# Altium schematic sheet ADC_AVN.SchDoc
size Tabloid; SheetNumber: 3; SheetTotal: 5
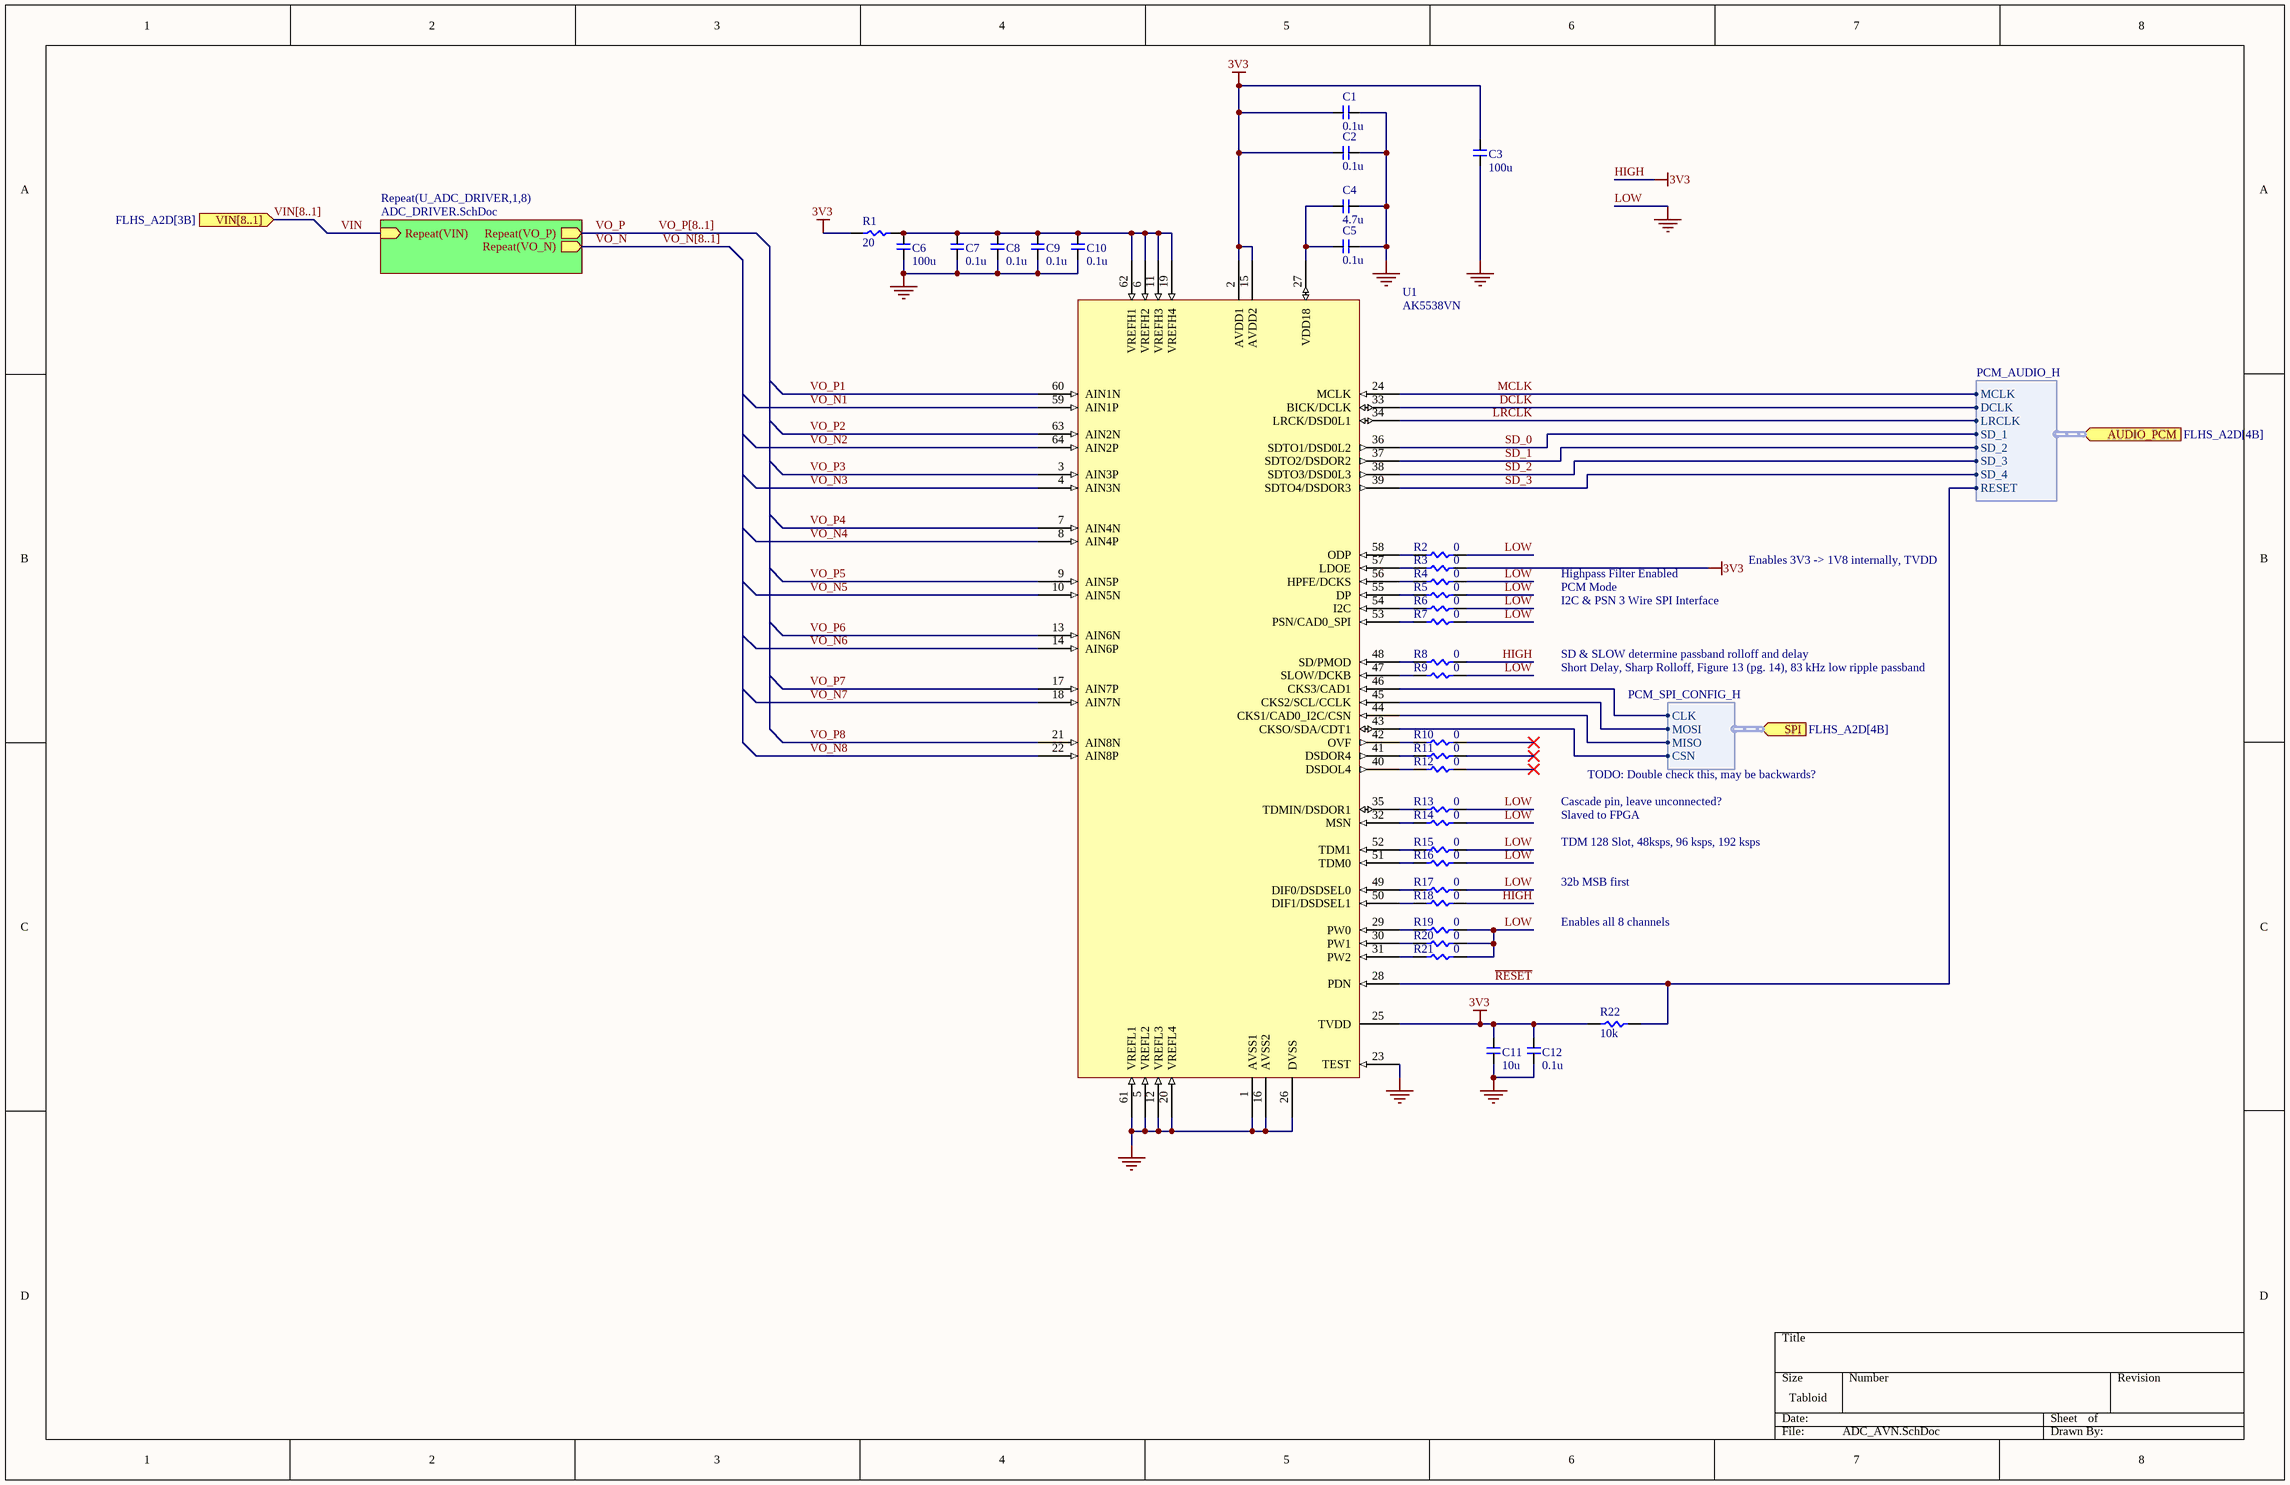
[diagram p0: ADC_AVN.SchDoc]

## Parts
C1  0.1u  [CAP_0402]
C2  0.1u  [CAP_0402]
C3  100u
C4  4.7u  [CAP_0603]
C5  0.1u  [CAP_0402]
C6  100u
C7  0.1u  [CAP_0402]
C8  0.1u  [CAP_0402]
C9  0.1u  [CAP_0402]
C10  0.1u  [CAP_0402]
C11  10u
C12  0.1u  [RES_0402]
R1  20  [RES_0402]
R2  0  [RES_0402]
R3  0  [RES_0402]
R4  0  [RES_0402]
R5  0  [RES_0402]
R6  0  [RES_0402]
R7  0  [RES_0402]
R8  0  [RES_0402]
R9  0  [RES_0402]
R10  0  [RES_0402]
R11  0  [RES_0402]
R12  0  [RES_0402]
R13  0  [RES_0402]
R14  0  [RES_0402]
R15  0  [RES_0402]
R16  0  [RES_0402]
R17  0  [RES_0402]
R18  0  [RES_0402]
R19  0  [RES_0402]
R20  0  [RES_0402]
R21  0  [RES_0402]
R22  10k  [RES_0402]
U1  AK5538VN  [AK5538VN_QFN127P600-8N]

## Sub-sheets
Repeat(U_ADC_DRIVER,1,8) = ADC_DRIVER.SchDoc: Repeat(VIN) (in), Repeat(VO_P) (out), Repeat(VO_N) (out)

## Ports
AUDIO_PCM (in, harness PCM_AUDIO_H, see FLHS_A2D[4B]), SPI (in, harness PCM_SPI_CONFIG_H, see FLHS_A2D[4B]), VIN[8..1] (in, see FLHS_A2D[3B])

## Harnesses
PCM_AUDIO_H: MCLK, DCLK, LRCLK, SD_1, SD_2, SD_3, SD_4, RESET
PCM_SPI_CONFIG_H: CLK, MOSI, MISO, CSN

## Nets
HIGH: C1.1 C2.1 C3.2 C11.2 C12.2 R1.1 R3.1 R8.1 R18.1 R22.1 U1.2(AVDD1) U1.15(AVDD2) U1.25(TVDD)  [also labelled 3V3]
LOW: C1.2 C2.2 C3.1 C4.2 C5.2 C6.1 C7.1 C8.1 C9.1 C10.1 C11.1 C12.1 R2.1 R4.1 R5.1 R6.1 R7.1 R9.1 R13.1 R14.1 R15.1 R16.1 R17.1 R19.1 R20.1 R21.1 U1.1(AVSS1) U1.5(VREFL2) U1.12(VREFL3) U1.16(AVSS2) U1.20(VREFL4) U1.23(TEST) U1.26(DVSS) U1.61(VREFL1)  [also labelled GND]
~{RESET}: R22.0 U1.28(PDN) ; port AUDIO_PCM.RESET
DCLK: U1.33(BICK/DCLK) ; port AUDIO_PCM.DCLK
LRCLK: U1.34(LRCK/DSD0L1) ; port AUDIO_PCM.LRCLK
MCLK: U1.24(MCLK) ; port AUDIO_PCM.MCLK
SD_0: U1.36(SDTO1/DSD0L2) ; port AUDIO_PCM.SD_1
SD_1: U1.37(SDTO2/DSDOR2) ; port AUDIO_PCM.SD_2
SD_2: U1.38(SDTO3/DSD0L3) ; port AUDIO_PCM.SD_3
SD_3: U1.39(SDTO4/DSDOR3) ; port AUDIO_PCM.SD_4
VIN: sheet Repeat(U_ADC_DRIVER,1,8)/Repeat(VIN)
VO_N: sheet Repeat(U_ADC_DRIVER,1,8)/Repeat(VO_N)
VO_N1: U1.59(AIN1P)
VO_N2: U1.64(AIN2P)
VO_N3: U1.4(AIN3N)
VO_N4: U1.8(AIN4P)
VO_N5: U1.10(AIN5N)
VO_N6: U1.14(AIN6P)
VO_N7: U1.18(AIN7N)
VO_N8: U1.22(AIN8P)
VO_P: sheet Repeat(U_ADC_DRIVER,1,8)/Repeat(VO_P)
VO_P1: U1.60(AIN1N)
VO_P2: U1.63(AIN2N)
VO_P3: U1.3(AIN3P)
VO_P4: U1.7(AIN4N)
VO_P5: U1.9(AIN5P)
VO_P6: U1.13(AIN6N)
VO_P7: U1.17(AIN7P)
VO_P8: U1.21(AIN8N)
NetC4_1: C4.1 C5.1 U1.27(VDD18)
NetC6_2: C6.2 C7.2 C8.2 C9.2 C10.2 R1.0 U1.6(VREFH2) U1.11(VREFH3) U1.19(VREFH4) U1.62(VREFH1)
NetR2_0: R2.0 U1.58(ODP)
NetR3_0: R3.0 U1.57(LDOE)
NetR4_0: R4.0 U1.56(HPFE/DCKS)
NetR5_0: R5.0 U1.55(DP)
NetR6_0: R6.0 U1.54(I2C)
NetR7_0: R7.0 U1.53(PSN/CAD0_SPI)
NetR8_0: R8.0 U1.48(SD/PMOD)
NetR9_0: R9.0 U1.47(SLOW/DCKB)
NetR10_0: R10.0 U1.42(OVF)
NetR11_0: R11.0 U1.41(DSDOR4)
NetR12_0: R12.0 U1.40(DSDOL4)
NetR13_0: R13.0 U1.35(TDMIN/DSDOR1)
NetR14_0: R14.0 U1.32(MSN)
NetR15_0: R15.0 U1.52(TDM1)
NetR16_0: R16.0 U1.51(TDM0)
NetR17_0: R17.0 U1.49(DIF0/DSDSEL0)
NetR18_0: R18.0 U1.50(DIF1/DSDSEL1)
NetR19_0: R19.0 U1.29(PW0)
NetR20_0: R20.0 U1.30(PW1)
NetR21_0: R21.0 U1.31(PW2)
NetU1_43: U1.43(CKSO/SDA/CDT1) ; port SPI.CSN
NetU1_44: U1.44(CKS1/CAD0_I2C/CSN) ; port SPI.MISO
NetU1_45: U1.45(CKS2/SCL/CCLK) ; port SPI.MOSI
NetU1_46: U1.46(CKS3/CAD1) ; port SPI.CLK

Not connected (* = marked no-connect by the designer): R10 1*; R11 1*; R12 1*

## Buses and harness runs
bus VIN[8..1] = port VIN[8..1]
bus VO_N[8..1]
bus VO_P[8..1]

## Notes on the sheet
- Enables 3V3 -> 1V8 internally, TVDD
- I2C & PSN 3 Wire SPI Interface
- PCM Mode
- Highpass Filter Enabled
- Short Delay, Sharp Rolloff, Figure 13 (pg. 14), 83 kHz low ripple passband
- SD & SLOW determine passband rolloff and delay
- Slaved to FPGA
- Cascade pin, leave unconnected?
- TODO: Double check this, may be backwards?
- 32b MSB first
- TDM 128 Slot, 48ksps, 96 ksps, 192 ksps
- Enables all 8 channels

## Library data of the parts
C1 C2 C5 C7-C10 = 0.1u: CAP CER 0.1uF 6V X7R 0402 10%
C3 C6 = 100u: CAP CER 100UF 6.3V X5R 1206 10%
C4 = 4.7u: CAP CER 4.7uF 6V X7R 0603 10%
C11 = 10u: CAP CER 10uF 6.3V X5R 0603
C12 = CAP_0402: 0.1u 0402 5V; Tolerance: *; Voltage Rating: *; Manufacturer: *; Part Number: *
R1 = RES_0402: 20 0402; Manufacturer: *; Part Number: *; Power Rating: *
R2-R21 = RES_0402: RES 0 OHM SMD 0402; Manufacturer: *; Part Number: *; Power Rating: *
R22 = RES_0402: 10k 0402; Manufacturer: *; Part Number: *; Power Rating: *
U1 = AK5538VN: ADC, Delta-Sigma, 32-Bit, 1 Func, 8 Channel, Serial Access, PQCC64; Manufacturer: Asahi Kasei; Supplier: DigiKey; Supplier Part Number: 974-1124-1-ND; Manufacturer Part Number: AK5538VN; Category: Data Converter ICs; Stock: 2414; Pricing: 1=9.4, 10=7.319, 25=6.7988, 100=6.2271, 250=5.9544, 500=5.79008 (USD); Schedule B: 8542390000